# EAGLE design AIRDCR (EAGLE 9.5.1)
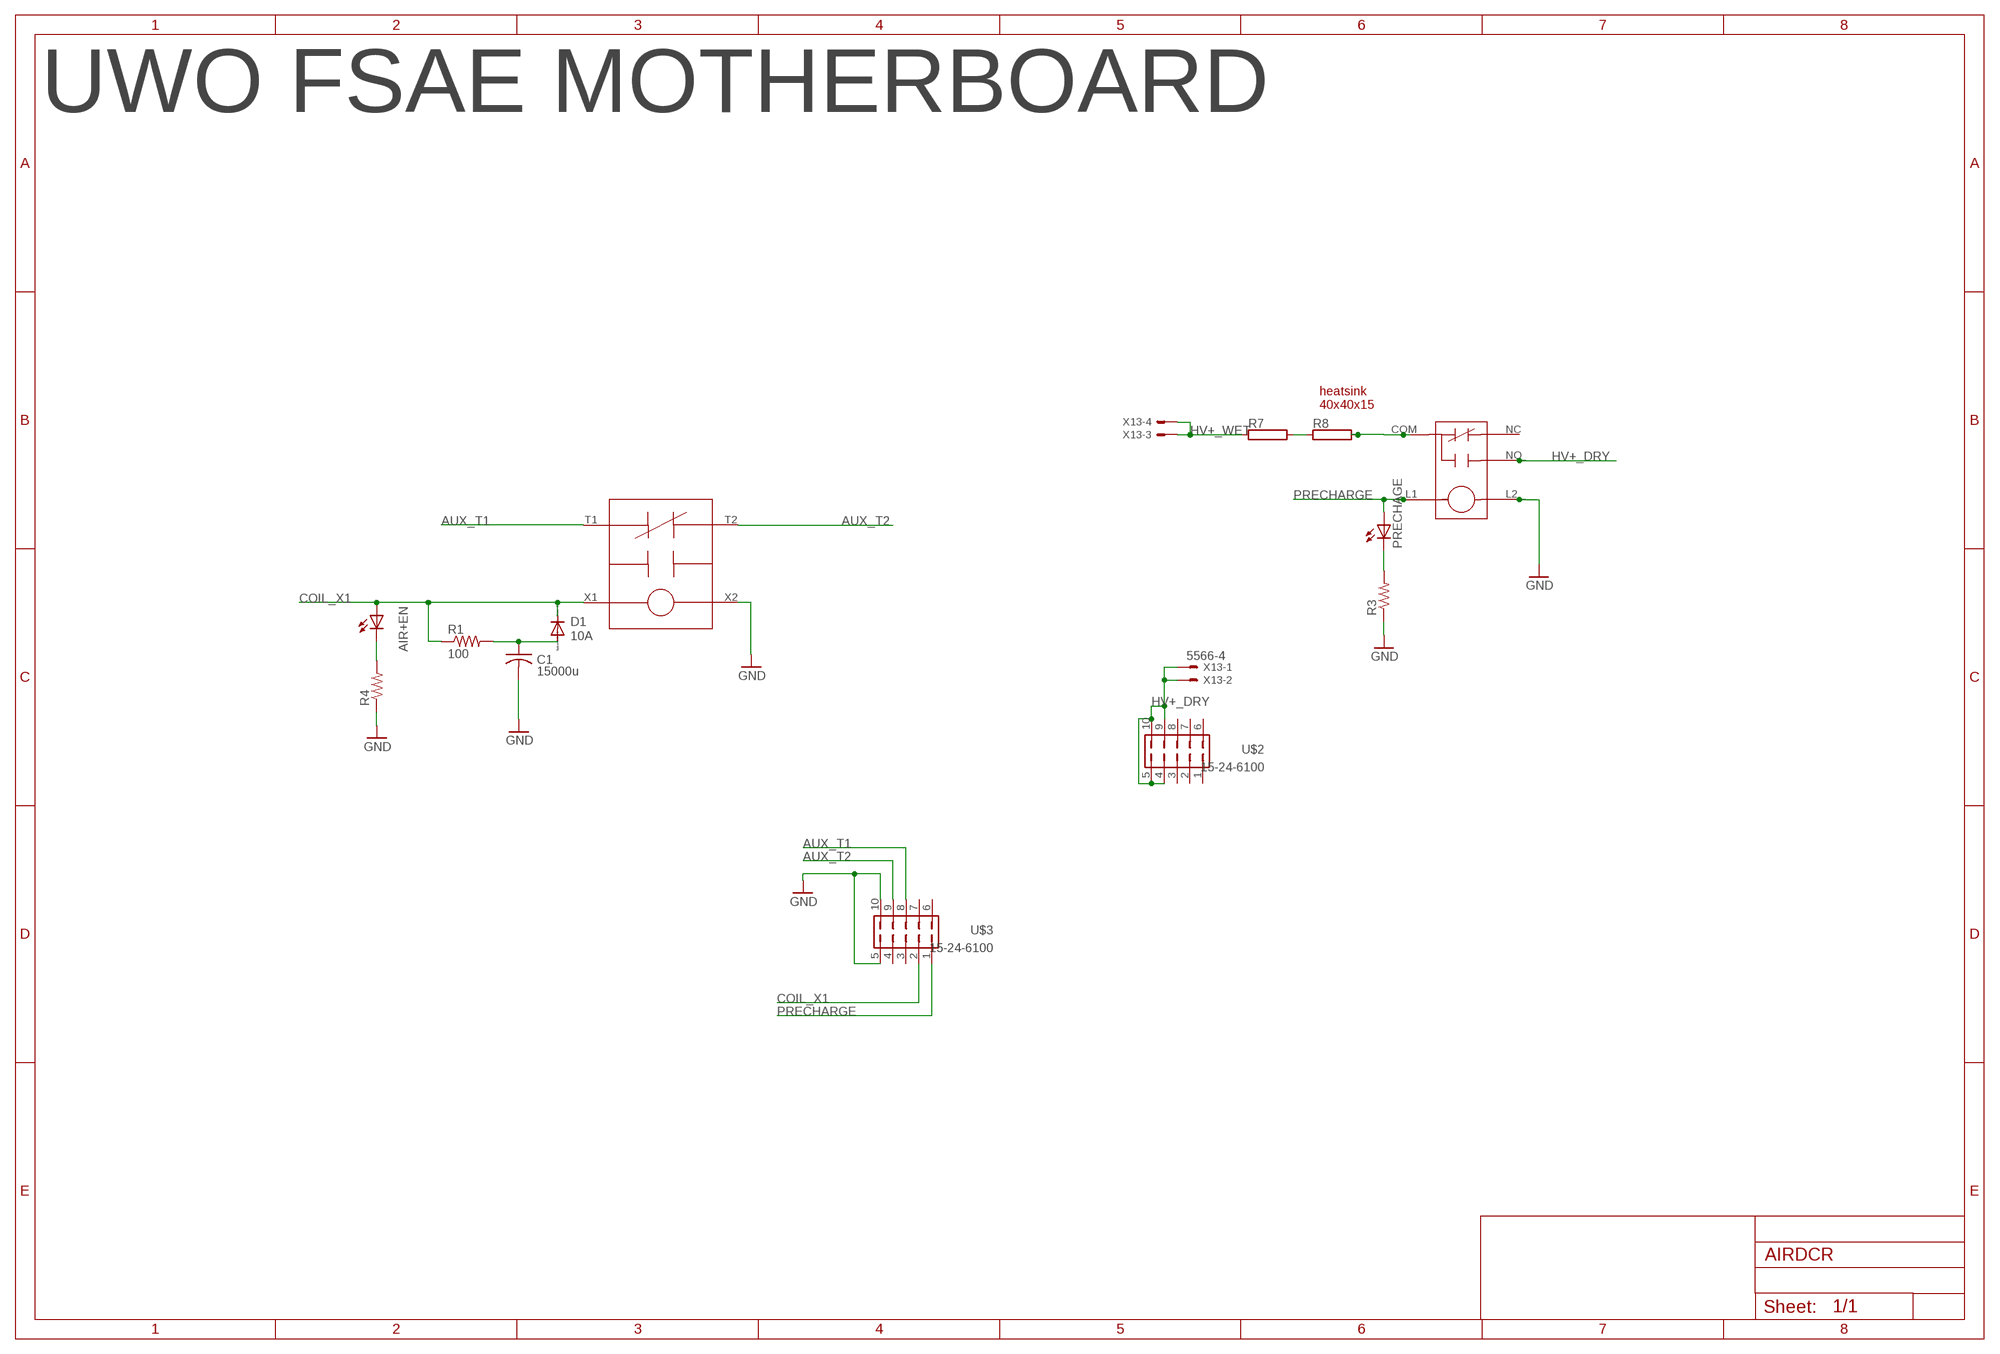
[diagram p0: schematic, sheet 1]

## Parts
AIR+EN  LED3MM  [LED3MM]
C1  15000u  AIR_HOLDUP_CAP  [CAPPRD750W65D1800H3700B]
D1  10A  AIR_HOLDUP_DIODE  [DIOAD1570W120L850D500B]
PRECHAGE  LED3MM  [LED3MM]
R1  100  AIR_HOLDUP_RESISTOR  [RESAD976W63L650D250B]
R3  R-US_R0805  [R0805]
R4  R-US_R0805  [R0805]
R7  RMG100-H  [TO-247-2H]
R8  RMG100-H  [TO-247-2H]
U$1  GV224  [GV224]
U$2  15-24-6100  [15-24-6100]
U$3  15-24-6100  [15-24-6100]
U$4  G81C335  [G81C335]
U$8  HEATSINK40X40X15  [HEATSINK40X40X15]
X13  5566-4  [5566-4]

## Nets
AUX_T1: U$1.T1 U$3.8
AUX_T2: U$1.T2 U$3.9
COIL_X1: AIR+EN.A D1.1(C) R1.1 U$1.X1 U$3.2
GND: C1.2 R3.1 R4.1 U$1.X2 U$3.5 U$3.10 U$4.L2
HV+_DRY: U$2.4 U$2.5 U$2.9 U$2.10 U$4.NO X13.1 X13.2
HV+_WET: R7.1 X13.3 X13.4
N$2: PRECHAGE.K(C) R3.2
N$3: C1.1 D1.2(A) R1.2
N$5: AIR+EN.K(C) R4.2
N$8: R7.2 R8.1
N$21: R8.2 U$4.COM
PRECHARGE: PRECHAGE.A U$3.1 U$4.L1
Unconnected: U$2.1 U$2.2 U$2.3 U$2.6 U$2.7 U$2.8 U$3.3 U$3.4 U$3.6 U$3.7 U$4.NC

## Notes on the sheet
- UWO FSAE MOTHERBOARD

## Library data of the parts
AIR+EN PRECHAGE = ACC-MB-R0:LED: LED OSRAM: - CHIPLED LG R971, LG N971, LY N971, LG Q971, LY Q971, LO R971, LY R971 LH N974, LH R974 LS Q976, LO Q976, LY Q976 LO Q996 - Hyper CHIPLED LW Q18S LB Q993, LB Q99A, LB R99A - SideLED LS A670, LO A670, LY A670, LG A670, LP A670 LB A673, LV A673, LT A673, LW A673 LH A674 LY A675 LS A676, LA A676, LO A676, LY A676, LW A676 LS A679, LY A679, LG A679 - Hyper Micro SIDELED® LS Y876, LA Y876, LO Y876, LY Y876 LT Y87S - SmartLED LW L88C, LW L88S LB L89C, LB L89S, LG L890 LS L89K, LO L89K, LY L89K LS L896, LA L896, LO L896, LY L896 - TOPLED LS T670, LO T670, LY T670, LG T670, LP T670 LSG T670, LSP T670, LSY T670, LOP T670, LYG T670 LG T671, LOG T671, LSG T671 LB T673, LV T673, LT T673, LW T673 LH T674 LS T676, LA T676, LO T676, LY T676, LB T676, LH T676, LSB T676, LW T676 LB T67C, LV T67C, LT T67C, LS T67K, LO T67K, LY T67K, LW E67C LS E67B, LA E67B, LO E67B, LY E67B, LB E67C, LV E67C, LT E67C LW T67C LS T679, LY T679, LG T679 LS T770, LO T770, LY T770, LG T770, LP T770 LB T773, LV T773, LT T773, LW T773 LH T774 LS E675, LA E675, LY E675, LS T675 LS T776, LA T776, LO T776, LY T776, LB T776 LHGB T686 LT T68C, LB T68C - Hyper Mini TOPLED® LB M676 - Mini TOPLED Santana® LG M470 LS M47K, LO M47K, LY M47K Source: http://www.osram.convergy.de LUXEON: - LUMILED® LXK2-PW12-R00, LXK2-PW12-S00, LXK2-PW14-U00, LXK2-PW14-V00 LXK2-PM12-R00, LXK2-PM12-S00, LXK2-PM14-U00 LXK2-PE12-Q00, LXK2-PE12-R00, LXK2-PE12-S00, LXK2-PE14-T00, LXK2-PE14-U00 LXK2-PB12-K00, LXK2-PB12-L00, LXK2-PB12-M00, LXK2-PB14-N00, LXK2-PB14-P00, LXK2-PB14-Q00 LXK2-PR12-L00, LXK2-PR12-M00, LXK2-PR14-Q00, LXK2-PR14-R00 LXK2-PD12-Q00, LXK2-PD12-R00, LXK2-PD12-S00 LXK2-PH12-R00, LXK2-PH12-S00 LXK2-PL12-P00, LXK2-PL12-Q00, LXK2-PL12-R00 Source: www.luxeon.com KINGBRIGHT: KA-3528ASYC Source: www.kingbright.com
C1 = Main:AIR_HOLDUP_CAP
D1 = Main:AIR_HOLDUP_DIODE
R1 = Main:AIR_HOLDUP_RESISTOR
R3 R4 = ACC-MB-R0:R-US_: RESISTOR, American symbol; SPICEPREFIX: R
R7 R8 = ACC-MB-R0:RMG100: TO-247 Power Resistor - RMG 100 Series Source: www.token.com.tw .. power-resistor-rmg100pdf; OC_FARNELL: unknown; OC_NEWARK: unknown
U$1 = ACC-MB-R0:GV224
U$2 U$3 = ACC-MB-R0:15-24-6100
U$4 = ACC-MB-R0:G81C335
U$8 = ACC-MB-R0:HEATSINK40X40X15
X13 = ACC-MB-R0:5566-4: Mini FIT connector 4 pol Source: http://www.molex.com; MF: MOLEX; OC_FARNELL: unknown; OC_NEWARK: unknown

## Net classes
0 default: width 0.2 mm, clearance 0.152 mm
1 LV: clearance 0.001 mm
2 HV: clearance 2.5 mm

## Board
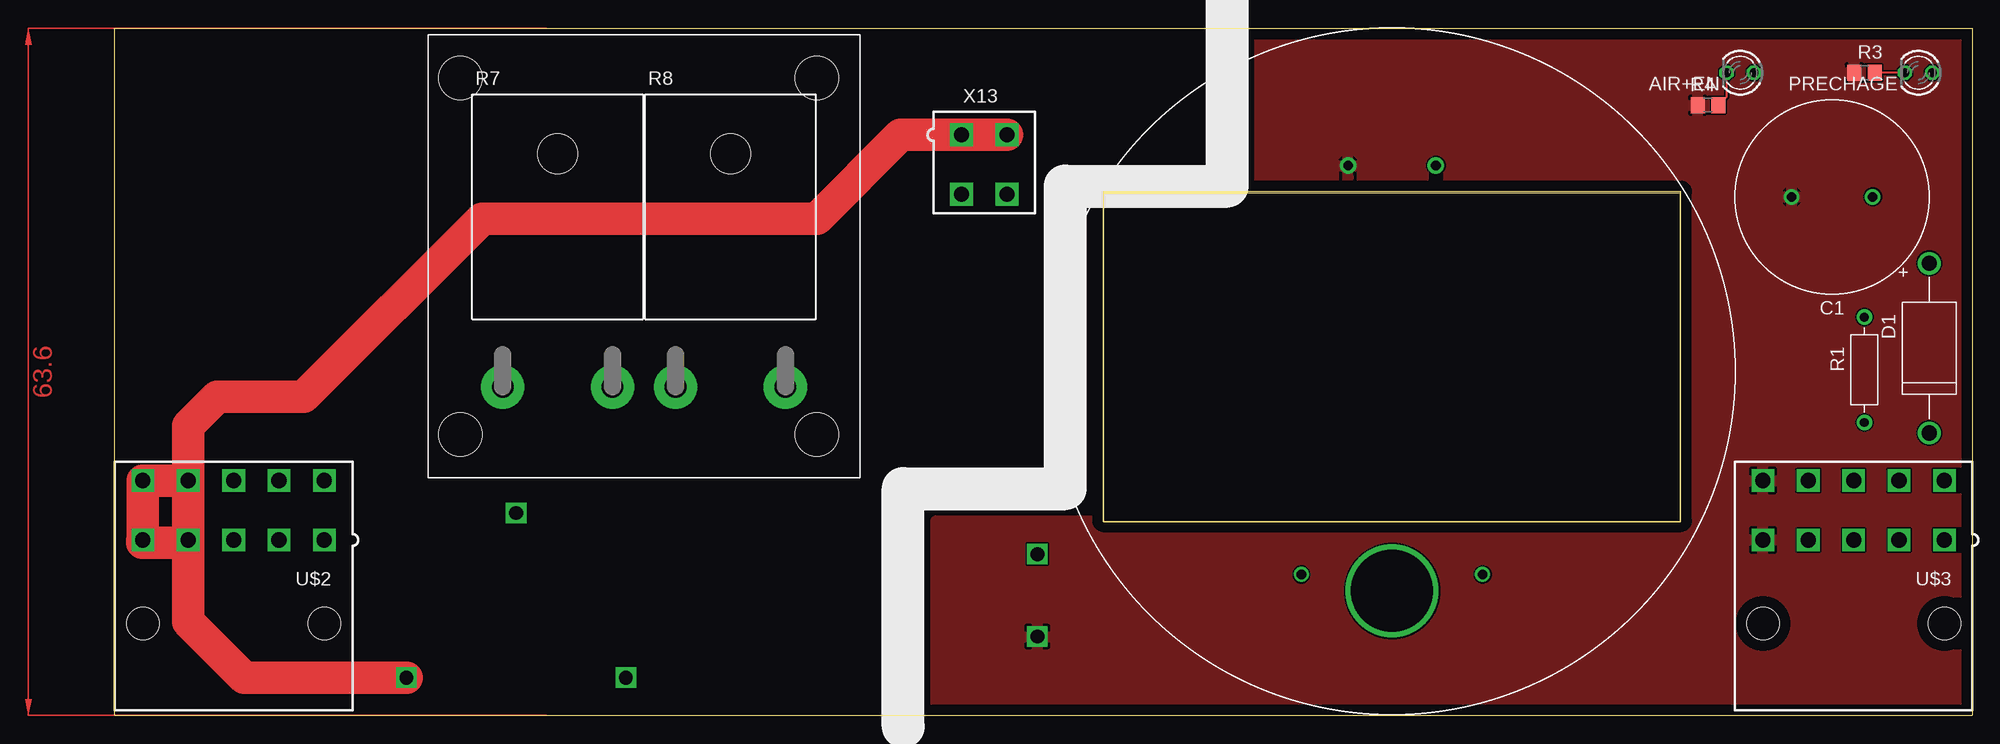
[diagram p1: board, top side]
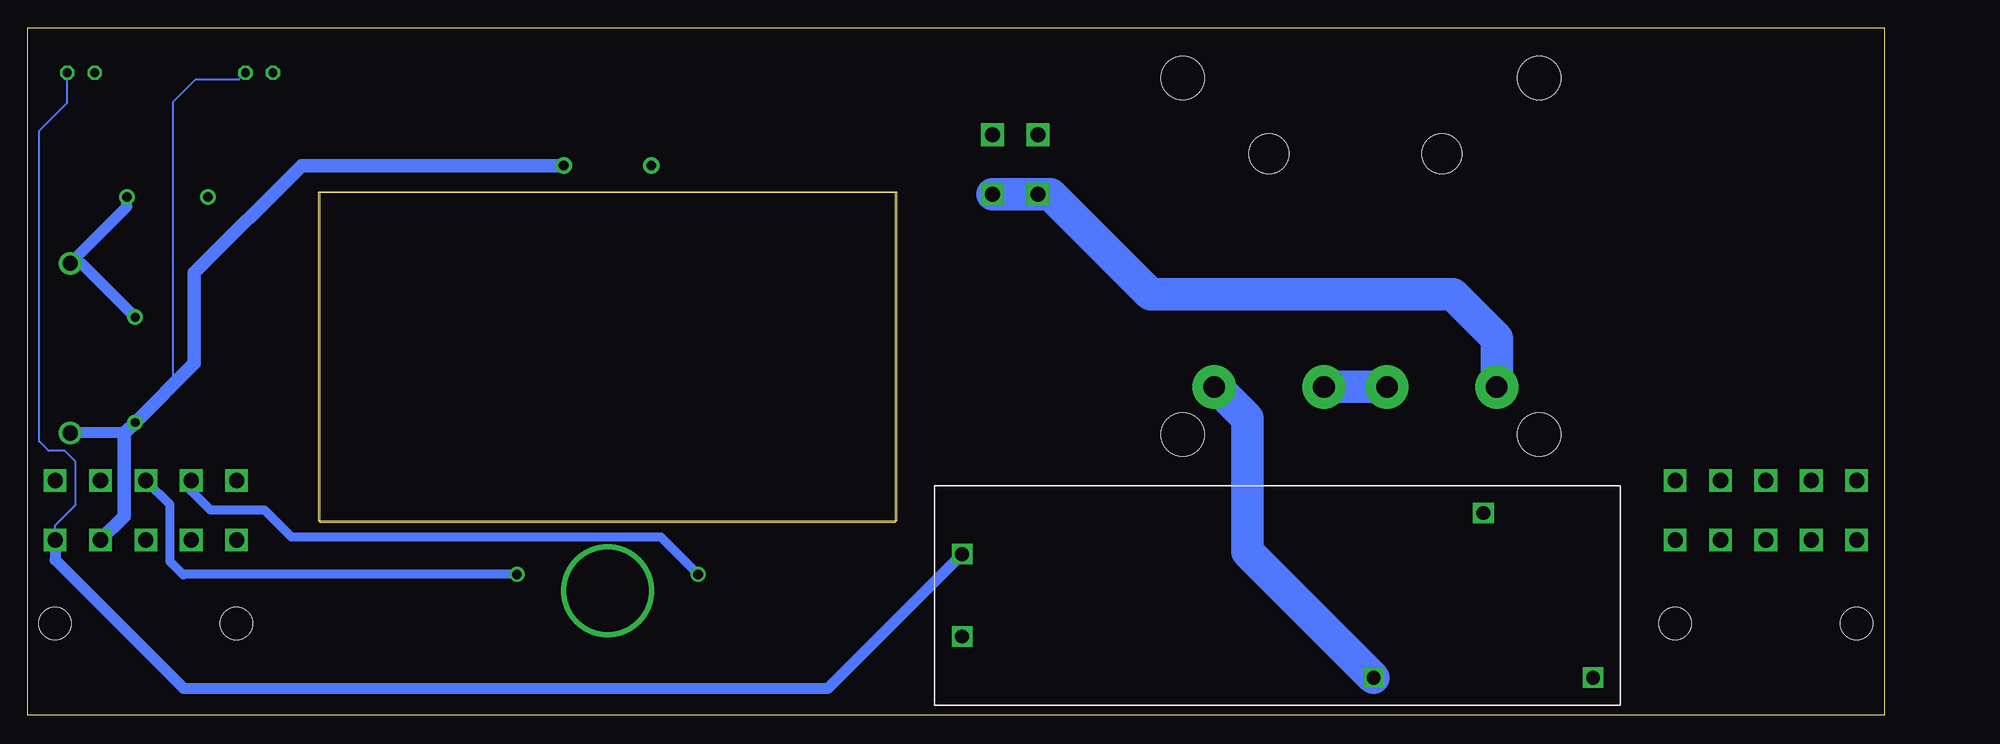
[diagram p2: board, bottom side, seen from below]

Size 172 x 63.6 mm. Coordinates in mm from the lower left corner, seen from the top.
Outline: 0,0 172,0 172,63.6 0,63.6 0,0
Outline: 91.5,48.5 91.5,18 145,18 145,48.5 91.5,48.5
Copper layers (1*16): Top 0.035mm / dielectric 1.5mm / Bottom 0.035mm
Design rules "default": minimum track width 6mil, minimum drill 0.35mm, track to track 6mil, track to pad 6mil, pad to pad 6mil, via to via 6mil, smd to smd 6mil, copper to edge 40mil, drill to drill 6mil, minimum pad ring 10mil, minimum via ring 8mil, stop-mask expansion 4mil, vias tented up to drill 0mil, thermal gap 10mil

### Footprints (pad centres in the part's own frame; a part is rotated, then mirrored left to right if it is on the bottom)
LED3MM = drill 0.813 octagon: A -1.27,0; K 1.27,0
CAPPRD750W65D1800H3700B = drill 0.85 pad 1.45: 1 -3.75,0; 2 3.75,0
DIOAD1570W120L850D500B = drill 1.4 pad 2.1: 1 -7.85,0; 2 7.85,0
RESAD976W63L650D250B = drill 0.83 pad 1.43: 1 -4.88,0; 2 4.88,0
R0805 = smd 1.3 x 1.5: 1 -0.95,0; 2 0.95,0
TO-247-2H = drill 2 pad 4: 1 -5.08,-21.59; 2 5.08,-21.59 | hole 3.7: 0,0
GV224 = drill 7.62: NC1 0,39.37 | drill 0.889: T1 -8.382,37.846; T2 8.382,37.846 | drill 0.889 pad 1.524: X1 -4.064,0; X2 4.064,0
15-24-6100 = drill 1.4 square: 1 8.4,-2.75; 2 4.2,-2.75; 3 0,-2.75; 4 -4.2,-2.75; 5 -8.4,-2.75; 6 8.4,2.75; 7 4.2,2.75; 8 0,2.75; 9 -4.2,2.75; 10 -8.4,2.75 | hole 3: 8.4,-10.5; -8.4,-10.5
G81C335 = drill 1.27 square: COM 20.32,0; L1 58.42,-11.43; L2 58.42,-3.81; NC 10.16,-15.24; NO 0,0
HEATSINK40X40X15 = hole 4: 0,0; 33,0; 33,33; 0,33
5566-4 = drill 1.4 square: 1 2.1,-2.75; 2 -2.1,-2.75; 3 2.1,2.75; 4 -2.1,2.75

### Placement (x,y rotation side)
AIR+EN  150.5,59.5 180 top
C1  159,48 180 top
D1  168,34 90 top
PRECHAGE  167,59.5 180 top
R1  162,32 90 top
R3  162,59.5 0 top
R4  147.5,56.5 0 top
R7  41,52 0 top
R8  57,52 0 top
U$1  118.25,50.91 180 top
U$2  11,19 0 top
U$3  161,19 0 top
U$4  27,3.5 180 bottom
U$8  65,26 90 top
X13  80.5,51 180 top

### Tracks (layer width: path | path; a pad name or v marks a point on that pad's centre or on a via)
AUX_T1
  Bottom 0.813: U$1.T1 157.44,13.06 157.5,13 158.75,14.25 158.75,19.5 U$3.8
AUX_T2
  Bottom 0.813: U$1.T2 113.3,16.5 147.5,16.5 150,19 155,19 156.8,20.8 U$3.9
COIL_X1
  Bottom 0.2: AIR+EN.A 152.38,58.89 156.38,58.89 158.5,56.77 158.5,30.62 R1.1
  Bottom 1: D1.1 163,26.15 162.97,26.15 162.97,18.48 U$3.2
  Bottom 1.27: 162.97,26.15 R1.1 156.5,32.62 156.5,41 146.59,50.91 U$1.X1 | 163,26.15 163,18.45 U$3.2
GND
  pour Top: 76,17 76,-8 180,-8 180,68 108,68 106,68 106,18 76,18
HV+_DRY
  Top 3: X13.2 X13.1 72.75,53.75 65,46 34,46 17.5,29.5 9.5,29.5 6.8,26.8 U$2.9 | U$2.9 U$2.4 | U$2.4 6.55,16 2.52,16 2.52,16.17 U$2.5 U$2.10 U$2.9 | U$2.4 6.8,8.7 12,3.5 U$4.NO
HV+_WET
  Bottom 3: R7.1 35.92,34.92 40,39 68,39 77.25,48.25 X13.3 X13.4
N$2
  Top 0.2: PRECHAGE.K R3.2
N$3
  Bottom 1: R1.2 166.97,41.85 D1.2 162.75,47.1 C1.1
N$5
  Top 0.2: R4.2 149.23,57.28 AIR+EN.K
N$8
  Bottom 3: R7.2 R8.1
N$21
  Bottom 3: R8.2 61.91,30.41 59,27.5 59,15.18 U$4.COM
PRECHARGE
  Bottom 0.2: U$3.1 169.4,17.6 167.5,19.5 167.5,23.5 168.5,24.5 170,24.5 170.88,25.38 170.88,54.12 168.27,56.73 PRECHAGE.A
  Bottom 1: U$3.1 169.4,14.4 157.5,2.5 97.85,2.5 U$4.L1
(copper drawn outside any net)
  shapes: Top area x1